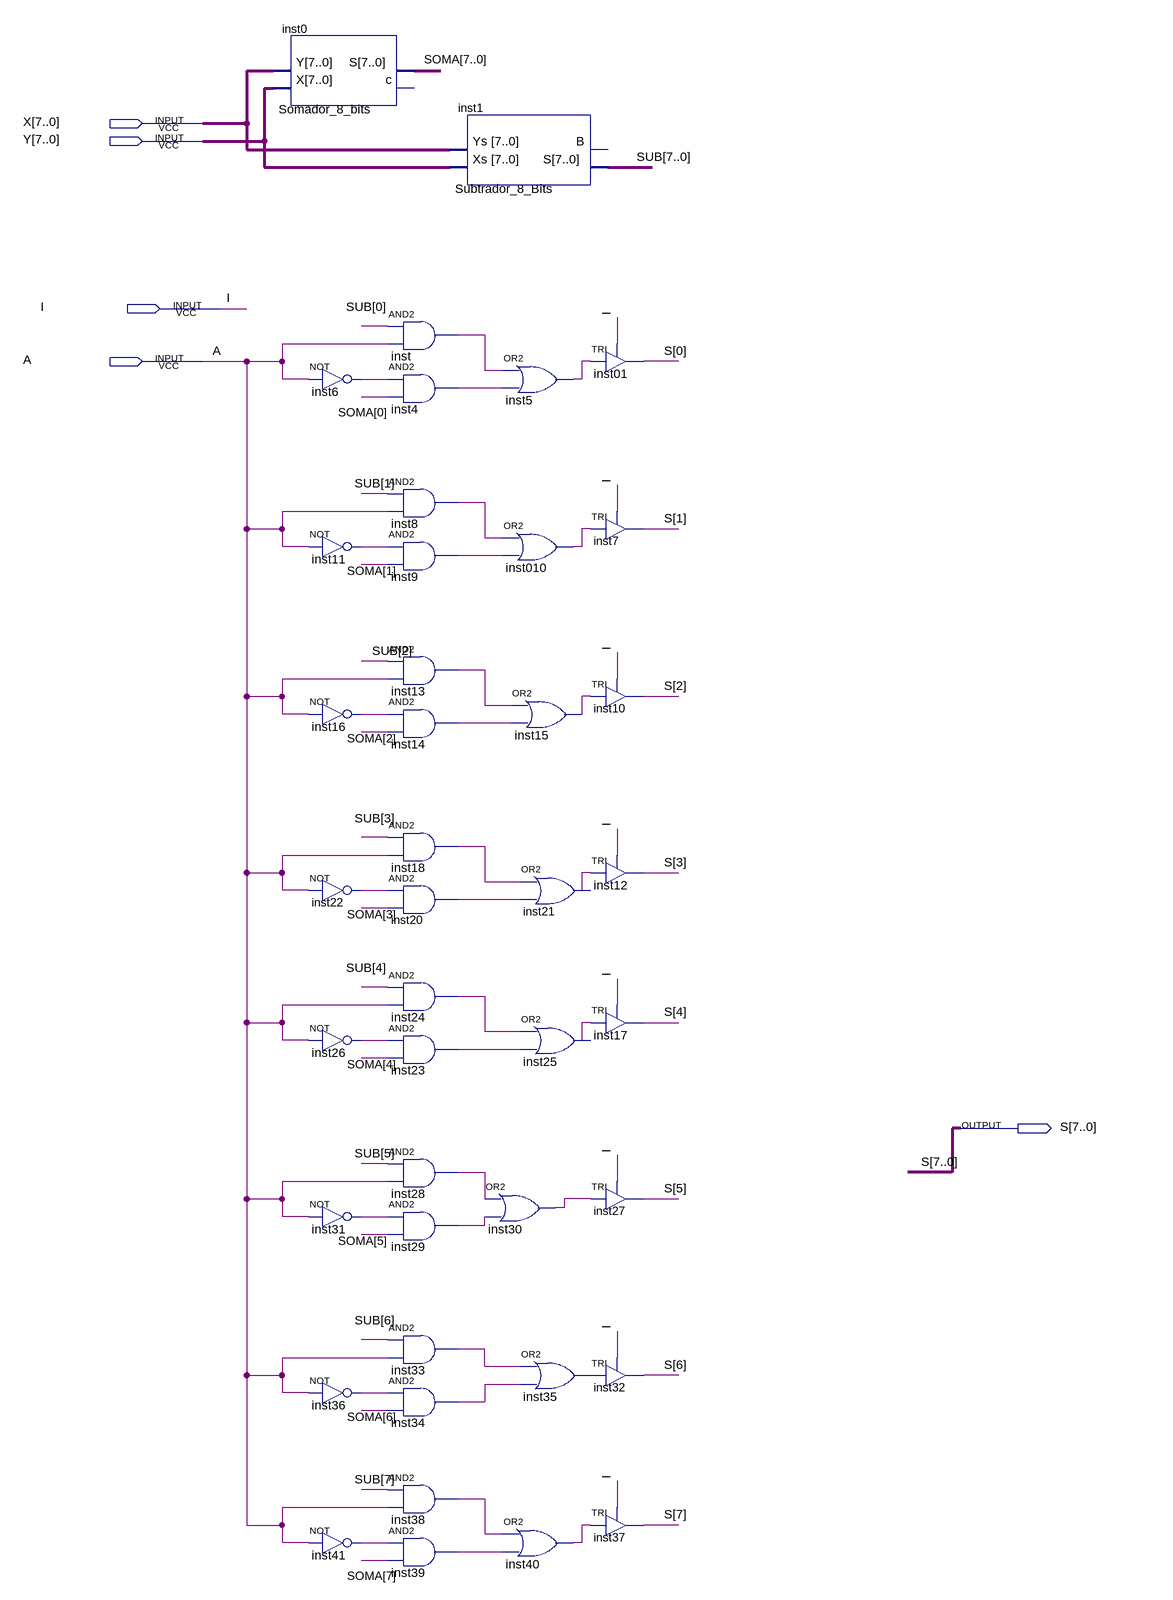
[diagram p0: schematic sheet]
// Quartus schematic SomadorSubtrador.bdf as structural Verilog: 42 symbols, 5 pins
module SomadorSubtrador (
  input  [7:0] X,
  input  [7:0] Y,
  input  I,
  input  A,
  output [7:0] S
);

  wire inst4_out, inst5_out, inst6_out, inst8_out, inst9_out, inst010_out, inst11_out, inst13_out,
       inst14_out, inst15_out, inst16_out, inst18_out, inst20_out, inst21_out, inst22_out, inst23_out,
       inst24_out, inst25_out, inst26_out, inst28_out, inst29_out, inst30_out, inst31_out, inst33_out,
       inst34_out, inst35_out, inst36_out, inst38_out, inst39_out, inst40_out, inst41_out, inst_out;
  wire [7:0] SOMA, SUB;

  Somador_8_bits inst0 (.X(Y), .Y(X), .S(SOMA));  // open: c
  not inst6 (inst6_out, A);
  not inst11 (inst11_out, A);
  not inst16 (inst16_out, A);
  not inst22 (inst22_out, A);
  not inst26 (inst26_out, A);
  not inst31 (inst31_out, A);
  not inst36 (inst36_out, A);
  not inst41 (inst41_out, A);
  and inst (inst_out, SUB[0], A);
  and inst4 (inst4_out, inst6_out, SOMA[0]);
  and inst8 (inst8_out, SUB[1], A);
  and inst9 (inst9_out, inst11_out, SOMA[1]);
  and inst13 (inst13_out, SUB[2], A);
  and inst14 (inst14_out, inst16_out, SOMA[2]);
  and inst18 (inst18_out, SUB[3], A);
  and inst20 (inst20_out, inst22_out, SOMA[3]);
  and inst24 (inst24_out, SUB[4], A);
  and inst23 (inst23_out, inst26_out, SOMA[4]);
  and inst28 (inst28_out, SUB[5], A);
  and inst29 (inst29_out, inst31_out, SOMA[5]);
  and inst33 (inst33_out, SUB[6], A);
  and inst34 (inst34_out, inst36_out, SOMA[6]);
  and inst38 (inst38_out, SUB[7], A);
  and inst39 (inst39_out, inst41_out, SOMA[7]);
  Subtrador_8_Bits inst1 (.Xs(Y), .Ys(X), .S(SUB));  // open: B
  or inst5 (inst5_out, inst_out, inst4_out);
  or inst010 (inst010_out, inst8_out, inst9_out);
  or inst15 (inst15_out, inst13_out, inst14_out);
  or inst21 (inst21_out, inst18_out, inst20_out);
  or inst25 (inst25_out, inst24_out, inst23_out);
  or inst30 (inst30_out, inst28_out, inst29_out);
  or inst35 (inst35_out, inst33_out, inst34_out);
  or inst40 (inst40_out, inst38_out, inst39_out);
  TRI inst01 (.IN(inst5_out), .OE(I), .OUT(S[0]));
  TRI inst7 (.IN(inst010_out), .OE(I), .OUT(S[1]));
  TRI inst10 (.IN(inst15_out), .OE(I), .OUT(S[2]));
  TRI inst12 (.IN(inst21_out), .OE(I), .OUT(S[3]));
  TRI inst17 (.IN(inst25_out), .OE(I), .OUT(S[4]));
  TRI inst27 (.IN(inst30_out), .OE(I), .OUT(S[5]));
  TRI inst32 (.IN(inst35_out), .OE(I), .OUT(S[6]));
  TRI inst37 (.IN(inst40_out), .OE(I), .OUT(S[7]));
endmodule
